# EasyEDA Pro project ProPrj_25电赛_2025-08-03-final.epro, board PCB4
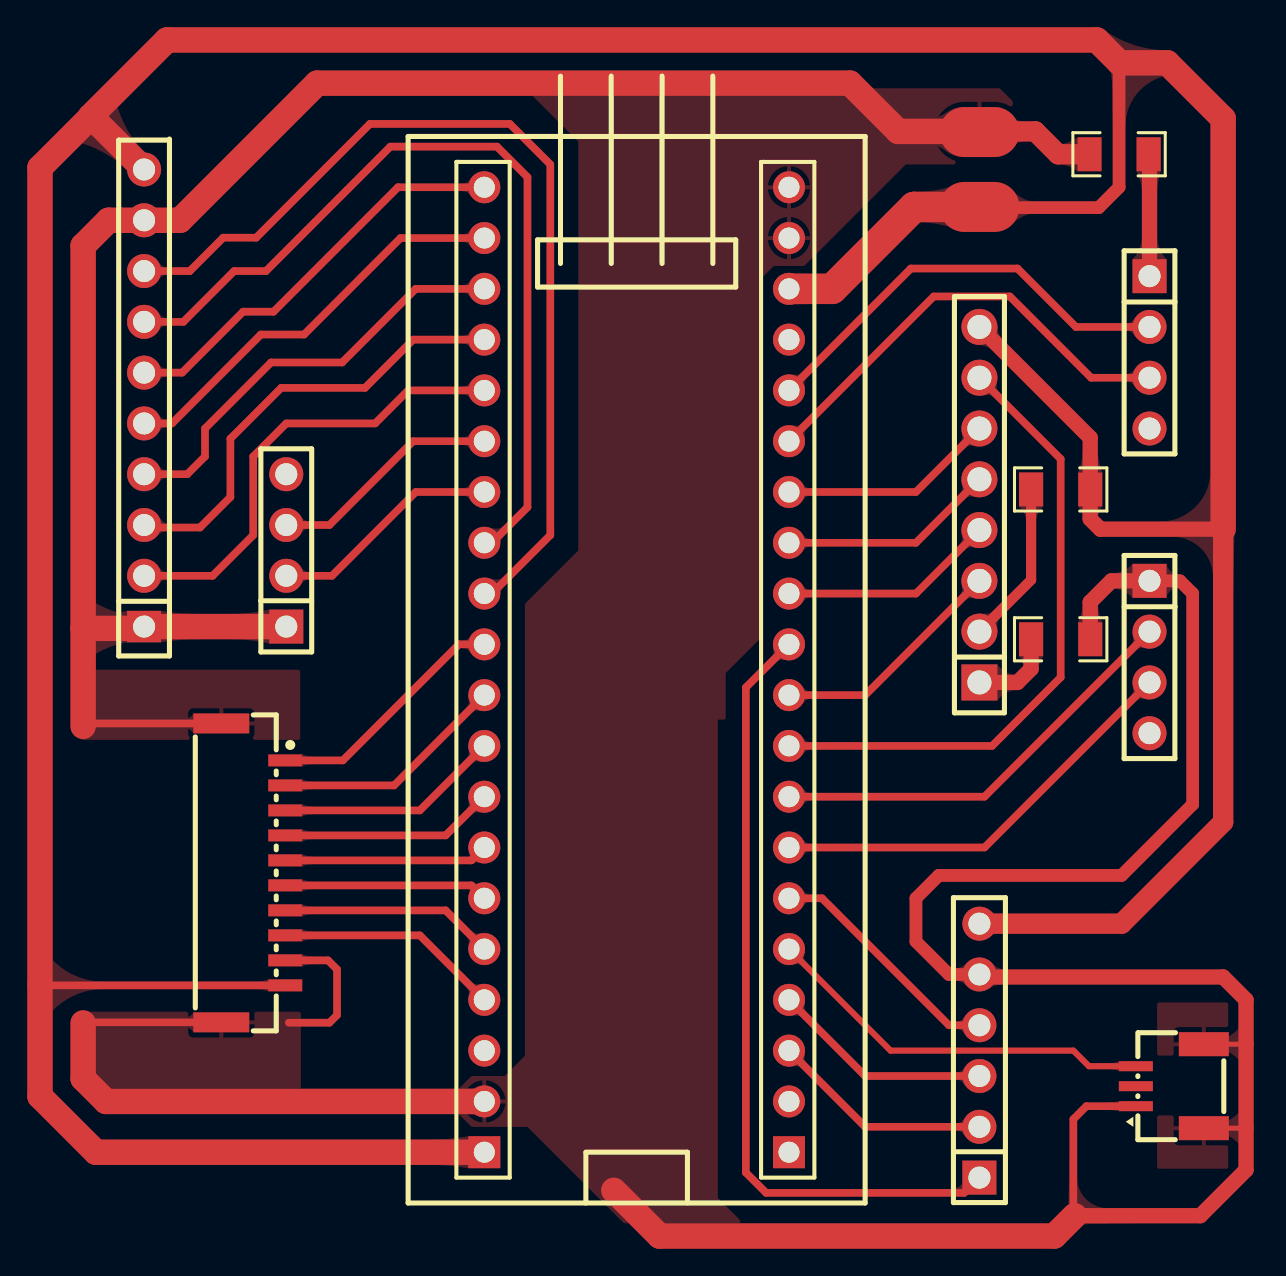
[diagram p8: board, top side]
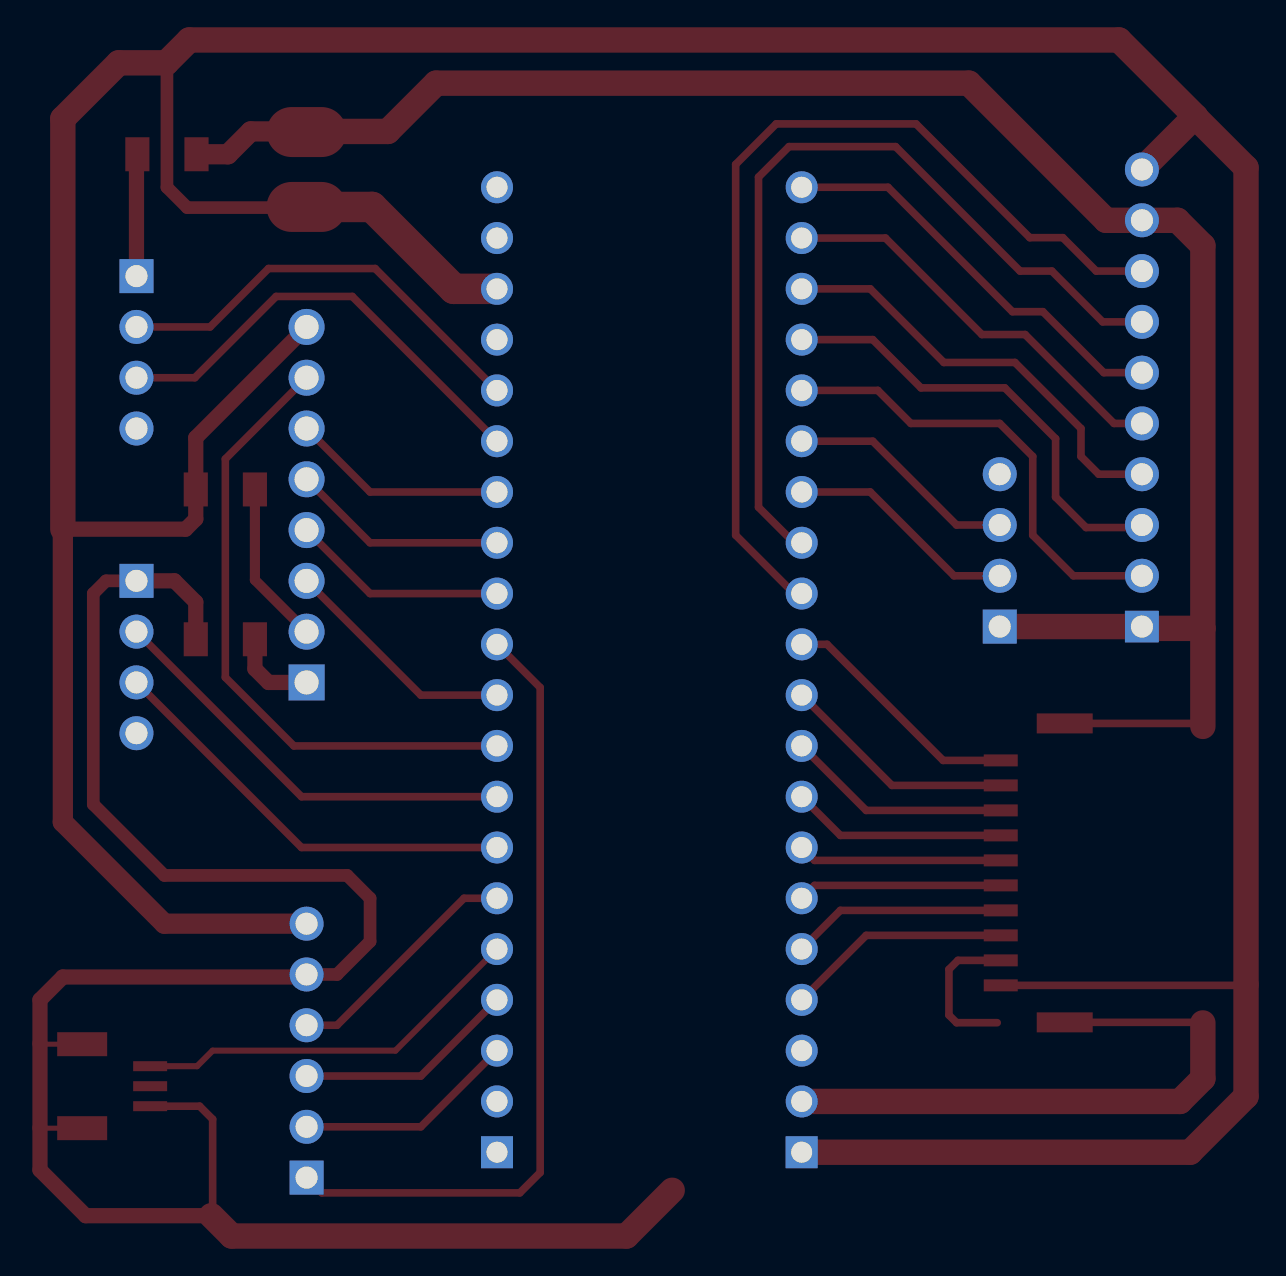
[diagram p9: board, bottom side, seen from below]

No outline. copper layers: Top Layer, Bottom Layer. Coordinates in mm from the lowest, leftmost part position.
Stack: Top Layer 0.035mm / Dielectric1 1.51mm FR4 er 4.5 / Bottom Layer 0.035mm

## Design rules (mm)
template: 自定义配置
spacing copperThickness1oz (default): track to track 0.102, other pairs 0.152 to 0.3
spacing copperThickness2oz: track to track 0.203, other pairs 0.152 to 0.3
track width copperThickness1oz (default): min 0.127, default 0.381, max 2.54
track width copperThickness2oz: min 0.203, default 0.254, max 2.54
differential pair differentialPair (default): width min 0.127, default 0.254, max 2.54; gap min 0.152, default 0.152
via viaSize (default): diameter min 0.5, default 0.61, max 10; hole min 0.3, default 0.305, max 6.3

## Placement (name value [footprint] x y rotation side)
H10  B-2100S04P-A110  [HDR-TH_4P-P2.54-V-M]  7.11 26.8 90 top
H11  B-2100S04P-A110  [HDR-TH_4P-P2.54-V-M]  50.29 36.7 270 top
H12  B-2100S04P-A110  [HDR-TH_4P-P2.54-V-M]  50.29 21.46 270 top
H15  PZ254V-11-06P  [HDR-TH_6P-P2.54-V-M]  41.78 1.78 90 top
H16  PZ254V-11-10P  [HDR-TH_10P-P2.54-V-M]  0 34.42 90 top
P1  2.54-1*8P母环保  [HDR-TH_8P-P2.54-V-F-1]  41.78 29.08 90 top
R200  0Ω  [R1206]  45.85 29.84 0 top
R201  0Ω  [R1206]  45.85 22.35 0 top
R202  0Ω  [R1206]  48.77 46.61 0 top
U2  CW32F030C8最小系统板  [STM32F103C8T6核心板]  24.64 20.83 180 top
U60  -  [2P焊接端子（大电流）]  41.78 45.85 180 top
U73  WAFER-GH1.25-10PWB  [CONN-SMD_10P-P1.25_XUNPU_WAFER-GH1.25-10PWB]  5.46 10.67 270 top
U75  ZX-SH1.0-3PWT  [CONN-SMD_3P-P1.00_MEGASTAR_ZX-SH1.0-3PWT]  51.31 0 90 top

## Footprints (pads in the part's own frame, mm; a bottom-side part is the same pattern mirrored in y, then rotated)
2P焊接端子（大电流）
  oval 4x2.5 smd: 1(0,1.873) 2(0,-1.873)
CONN-SMD_3P-P1.00_MEGASTAR_ZX-SH1.0-3PWT
  rect 0.5x1.7 smd: 1(-1,1.7) 2(0,1.7) 3(1,1.7)
  rect 1.2x2.5 smd: 4(-2.1,-1.7) 5(2.1,-1.7)
CONN-SMD_10P-P1.25_XUNPU_WAFER-GH1.25-10PWB
  rect 0.6x1.7 smd: 1(-5.625,1.6) 2(-4.375,1.6) 3(-3.125,1.6) 4(-1.875,1.6) 5(-0.625,1.6) 6(0.625,1.6) 7(1.875,1.6) 8(3.125,1.6) 9(4.375,1.6) 10(5.625,1.6)
  rect 1x2.8 smd: 11(7.475,-1.6) 12(-7.475,-1.6)
HDR-TH_4P-P2.54-V-M
  rect 1.7x1.7 hole 1.1: 1(-3.81,0)
  round 1.7 hole 1.1: 2(-1.27,0) 3(1.27,0) 4(3.81,0)
HDR-TH_6P-P2.54-V-M
  rect 1.7x1.7 hole 1.1: 1(-6.35,0)
  round 1.7 hole 1.1: 2(-3.81,0) 3(-1.27,0) 4(1.27,0) 5(3.81,0) 6(6.35,0)
HDR-TH_8P-P2.54-V-F-1
  rect 1.8x1.8 hole 1.2: 1(-8.89,0)
  round 1.8 hole 1.2: 2(-6.35,0) 3(-3.81,0) 4(-1.27,0) 5(1.27,0) 6(3.81,0) 7(6.35,0) 8(8.89,0)
HDR-TH_10P-P2.54-V-M
  rect 1.575x1.7 hole 1.1: 1(-11.43,0)
  round 1.7 hole 1.1: 2(-8.89,0) 3(-6.35,0) 4(-3.81,0) 5(-1.27,0) 6(1.27,0) 7(3.81,0) 8(6.35,0) 9(8.89,0) 10(11.43,0)
R1206
  rect 1.208x1.701 smd: 1(-1.479,0) 2(1.479,0)
STM32F103C8T6核心板
  rect 1.6x1.6 hole 1.049: 1(-7.62,24.13) 40(7.62,24.13)
  round 1.6 hole 1.049: 2(-7.62,21.59) 3(-7.62,19.05) 4(-7.62,16.51) 5(-7.62,13.97) 6(-7.62,11.43) 7(-7.62,8.89) 8(-7.62,6.35) 9(-7.62,3.81) 10(-7.62,1.27) 11(-7.62,-1.27) 12(-7.62,-3.81) 13(-7.62,-6.35) 14(-7.62,-8.89) 15(-7.62,-11.43) 16(-7.62,-13.97) 17(-7.62,-16.51) 18(-7.62,-19.05) 19(-7.62,-21.59) 20(-7.62,-24.13) 21(7.62,-24.13) 22(7.62,-21.59) 23(7.62,-19.05) 24(7.62,-16.51) 25(7.62,-13.97) 26(7.62,-11.43) 27(7.62,-8.89) 28(7.62,-6.35) 29(7.62,-3.81) 30(7.62,-1.27) 31(7.62,1.27) 32(7.62,3.81) 33(7.62,6.35) 34(7.62,8.89) 35(7.62,11.43) 36(7.62,13.97) 37(7.62,16.51) 38(7.62,19.05) 39(7.62,21.59)

## Nets
As in the schematic.

Pads without a net: H10 4; H11 4; H12 4; U2 1 2 17 38; U75 2

## Routing (per net, layer and track width the routed paths; a pad name or vN(x,y) marks a point on that pad's centre or on a via; arc(x,y) is an arc through that point)
GND: length 251.7
  Top Layer w0.254: 55.12,2.13 55.09,2.1 U75.5 ; 55.12,-2.08 55.1,-2.1 U75.4
  Top Layer w0.381: -3.05,3.16 -3.02,3.19 3.86,3.19 ; U73.12 -2.9,18.14 -3.05,18 ; 7.24,3.17 9.27,3.17 9.65,3.56 9.65,5.84 9.2,6.29 U73.9 ; 46.55,-6.48 46.48,-6.41 46.48,-1.65 47.13,-1 U75.1
  Top Layer w0.635: H12.1 51.81,25.27 52.45,24.64 52.45,14.1 48.9,10.54 39.75,10.54 38.61,9.4 38.61,7.24 40.26,5.59 H15.5
  Top Layer w0.762: H15.5 41.91,5.46 53.97,5.46 55.12,4.32 55.12,-4.19 52.83,-6.48 46.55,-6.48 ; H11.1 50.29,46.44 50.12,46.61 ; R201.1 44.37,20.87 43.69,20.19 P1.1 ; R201.2 47.33,24.21 48.39,25.27 H12.1
  Top Layer w1.016: 42.67,47.75 44.58,47.75 45.72,46.61 47.16,46.61
  Top Layer w1.27: -3.05,22.9 -0.09,22.9 0,22.99 7.11,22.99 ; -3.05,22.9 -3.05,42.04 -1.78,43.31 H16.9 1.8,43.31 8.65,50.17 35.31,50.17 37.72,47.75 40.89,47.75 ; -3.05,22.9 -3.05,18 ; 46.55,-6.48 45.53,-7.49 25.78,-7.49 23.5,-5.21 ; U2.39 -1.91,-0.76 -3.05,0.38 -3.05,3.16
VCC_3V3: length 249.8
  Top Layer w0.381: -5.21,5.08 -5.17,5.04 U73.10
  Top Layer w0.508: R200.1 44.37,25.32 P1.2
  Top Layer w0.635: 48.8,51.18 48.77,51.15 48.77,44.96 47.75,43.94 42.67,43.94
  Top Layer w0.762: P1.8 47.33,32.43 R200.2 47.33,28.37 47.83,27.86 53.97,27.86
  Top Layer w1.016: H15.6 48.9,8.13 53.97,13.21 53.97,27.86
  Top Layer w1.27: -2.65,48.5 -5.21,45.94 -5.21,-0.51 -2.41,-3.3 U2.40 ; -2.65,48.5 H16.10 ; -2.65,48.5 -2.68,48.5 1.14,52.32 47.66,52.32 48.8,51.18 51.18,51.18 53.97,48.39 53.97,27.86
  Top Layer w1.524: U2.18 34.42,39.88 38.51,43.97 U60.1
ADC: length 19.8
  Top Layer w0.305: U75.3 47.26,1 46.48,1.78 37.34,1.78 U2.5
BTN0: length 12.4
  Top Layer w0.381: U73.1 9.94,16.29 15.75,22.1 U2.30
BTN1: length 11.8
  Top Layer w0.381: U2.31 12.5,15.04 U73.2
BTN2: length 11.3
  Top Layer w0.381: U2.32 13.79,13.79 U73.3
BTN3: length 10.8
  Top Layer w0.381: U2.33 15.08,12.54 U73.4
BTN4: length 10.2
  Top Layer w0.381: U73.5 16.37,11.29 U2.34
BTN5: length 10.2
  Top Layer w0.381: U2.35 16.37,10.04 U73.6
BTN6: length 10.8
  Top Layer w0.381: U73.7 15.08,8.79 U2.36
BTN7: length 11.3
  Top Layer w0.381: U73.8 13.79,7.54 U2.37
IPS_CS: length 31.7
  Top Layer w0.381: U2.9 42.42,17.02 45.85,20.45 45.85,31.37 P1.7
IPS_DC: length 10.8
  Top Layer w0.381: P1.6 38.61,29.72 U2.14
IPS_RES: length 10.8
  Top Layer w0.381: P1.5 38.61,27.18 U2.13
IPS_SCL: length 11.9
  Top Layer w0.381: P1.3 36.07,19.56 U2.10
IPS_SDA: length 10.8
  Top Layer w0.381: P1.4 38.61,24.64 U2.12
PA1: length 12.2
  Top Layer w0.381: U2.6 33.91,9.4 40.26,3.05 H15.4
PA6: length 39.7
  Top Layer w0.381: H15.1 41.02,-5.33 31.12,-5.33 30.1,-4.32 30.1,19.94 U2.11
PA8: length 23.2
  Top Layer w0.381: H16.2 3.43,25.53 5.46,27.56 5.46,31.5 7.11,33.15 11.56,33.15 13.21,34.8 U2.25
PA11: length 42.8
  Top Layer w0.381: U2.28 17.4,27.18 19.18,28.96 19.18,45.47 17.65,46.99 12.32,46.99 6.1,40.77 4.5,40.77 1.96,38.23 H16.7
PA12: length 47.3
  Top Layer w0.381: U2.29 17.4,24.64 20.32,27.56 20.32,46.1 18.29,48.13 11.3,48.13 5.61,42.44 3.96,42.44 2.29,40.77 H16.8
PB12: length 20.9
  Top Layer w0.381: H16.6 1.91,35.69 4.95,38.73 6.48,38.73 12.7,44.96 U2.21
PB13: length 20.9
  Top Layer w0.381: H16.5 1.4,33.15 5.84,37.59 8,37.59 12.83,42.42 U2.22
PB14: length 21.7
  Top Layer w0.381: U2.23 13.59,39.88 9.91,36.2 6.35,36.2 3.05,32.89 3.05,31.5 2.16,30.61 H16.4
PB15: length 22.7
  Top Layer w0.381: H16.3 0.13,27.94 2.79,27.94 4.32,29.46 4.32,32.39 6.86,34.92 11.05,34.92 13.46,37.34 U2.24
PC14: length 11.1
  Top Layer w0.381: H15.2 36.07,-2.03 U2.3
PC15: length 11.1
  Top Layer w0.381: U2.4 36.07,0.51 H15.3
USART1_RX: length 11.6
  Top Layer w0.381: H10.2 9.4,25.53 13.59,29.72 U2.27
USART1_TX: length 11.6
  Top Layer w0.381: U2.26 13.46,32.26 9.27,28.07 7.11,28.07
USART2_RX: length 21.5
  Top Layer w0.381: H12.2 42.04,14.48 U2.8
USART2_TX: length 21.5
  Top Layer w0.381: H12.3 42.04,11.94 U2.7
USART3_RX: length 21.8
  Top Layer w0.381: U2.16 38.35,40.89 43.69,40.89 46.61,37.97 H11.2
USART3_TX: length 22.7
  Top Layer w0.381: H11.3 47.37,35.43 43.31,39.5 39.5,39.5 U2.15

## Copper pours and planes (outline as drawn; the poured copper is in the pictures)
GND on Top Layer: -3.17,3.73 7.84,3.73 7.84,-0.13 -3.17,-0.13
GND on Top Layer: 50.67,-1.46 54.23,-1.46 54.23,-4.13 50.67,-4.13
GND on Top Layer: 21.72,47.24 21.72,19.47 22.86,18.33 29.1,18.33 29.1,20.67 30.77,22.34 30.77,40.29 31.5,41.02 33.02,41.02 38.1,46.1 43.05,46.1 43.46,46.5 43.46,49.25 42.8,49.91 19.43,49.91 19.43,49.53
GND on Top Layer: 21.97,27.05 19.05,24.13 19.05,1.52 18.03,0.51 16.38,0.51 15.75,-0.13 15.75,-1.4 16.38,-2.03 19.18,-2.03 24,-6.86 29.97,-6.86 28.7,-5.59 28.7,21.21 22.86,27.05
GND on Top Layer: 50.67,4.19 54.23,4.19 54.23,1.52 50.67,1.52
GND on Top Layer: -3.17,20.83 7.81,20.83 7.81,17.31 -3.17,17.31

Small or netless copper shapes (teardrops, artwork), in the pictures only: 110 on Top Layer
